# EAGLE design DAC (EAGLE 7.7.0)

## Sheet 1 of 2
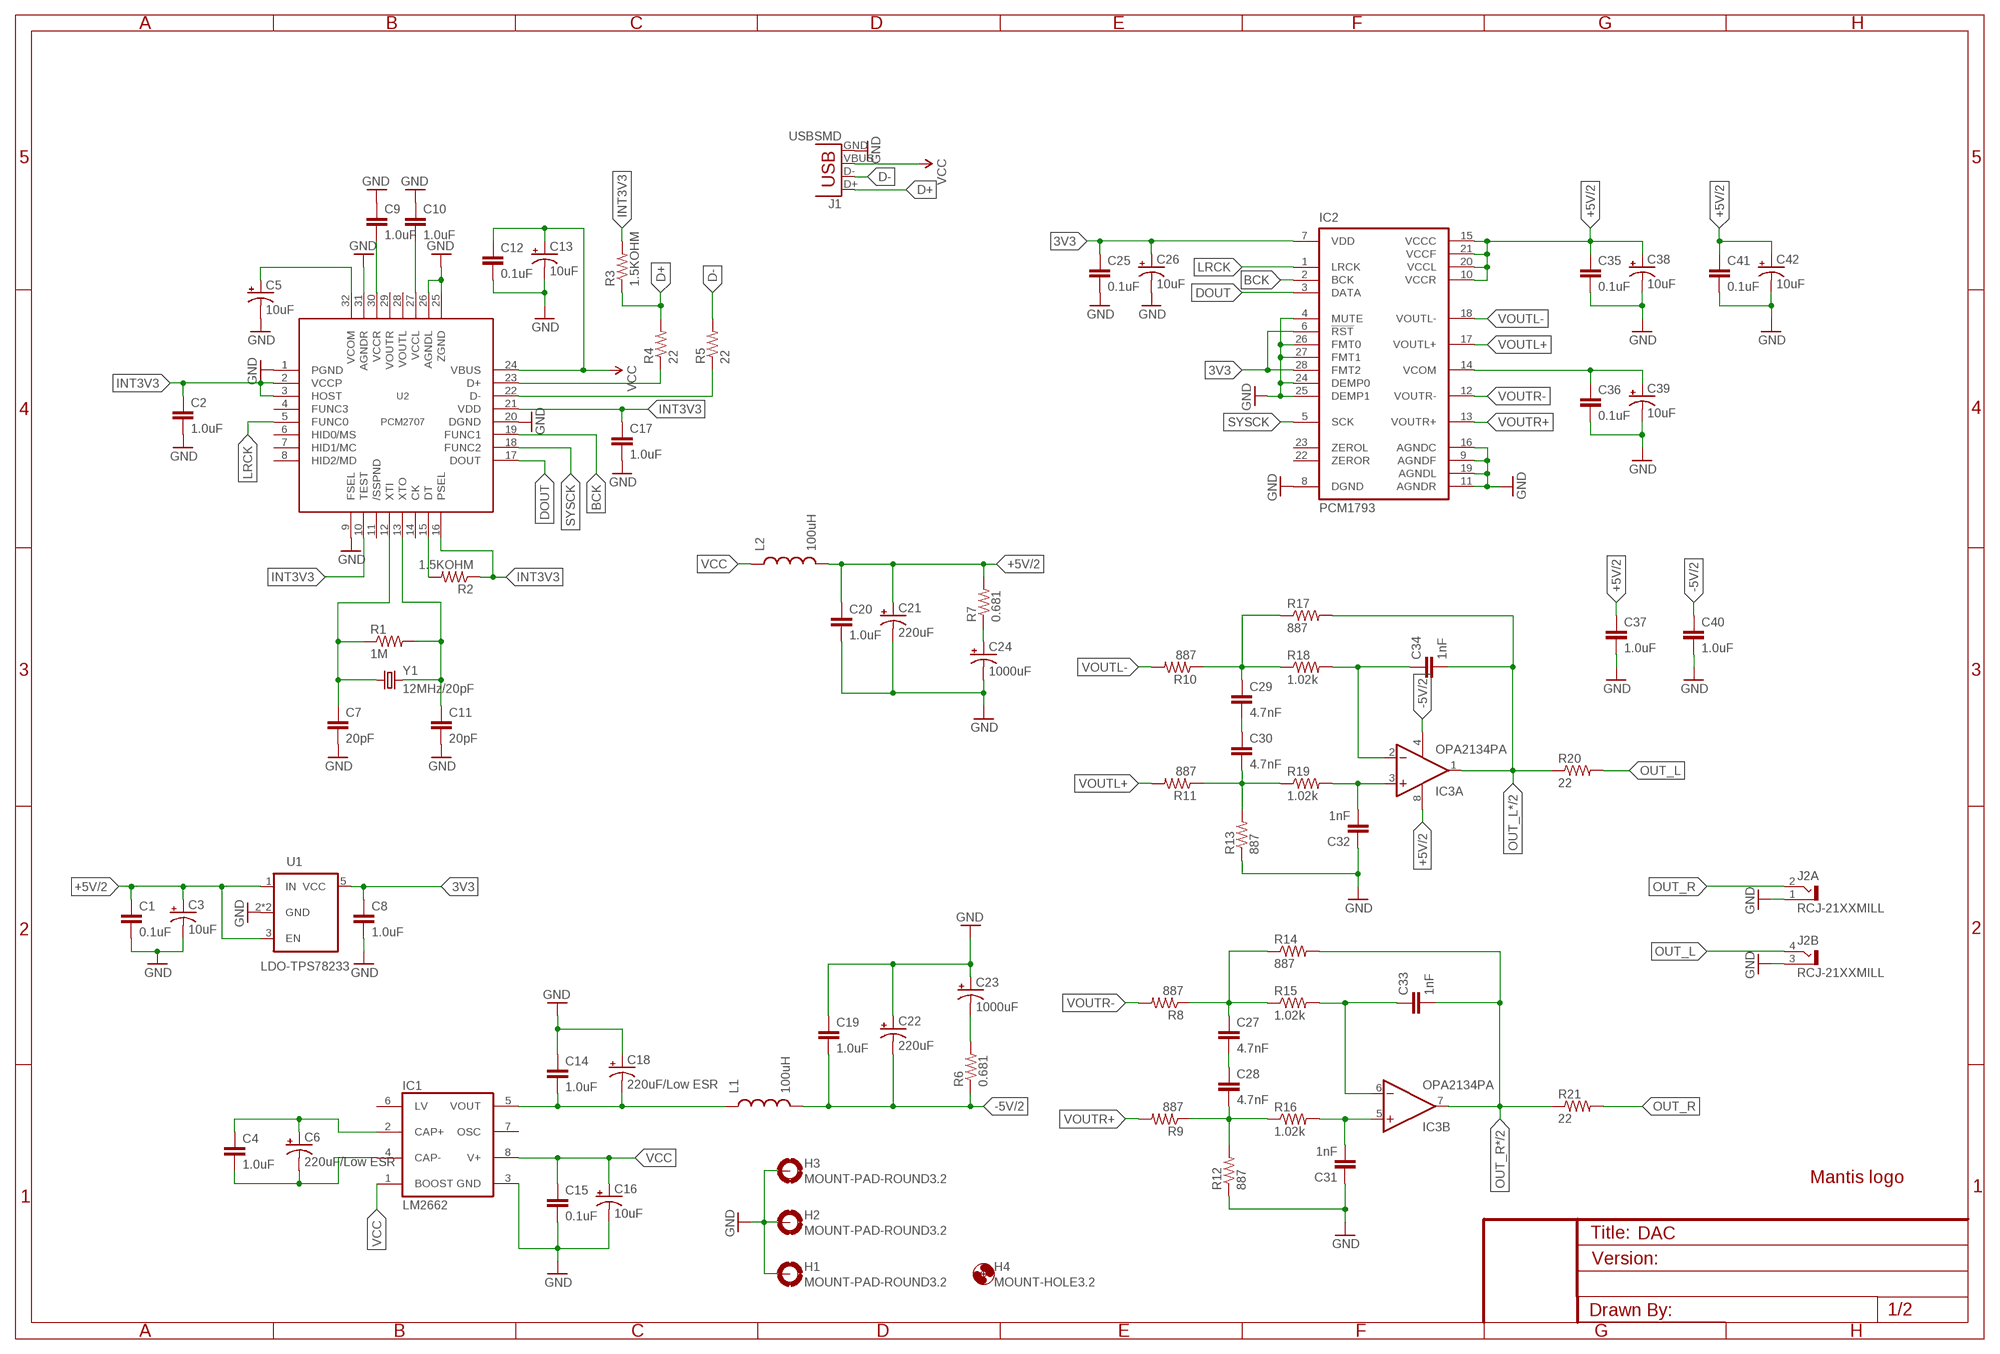
[diagram p0: schematic, sheet 1]

### Parts
C1  0.1uF  0.1UF-25V-5%(0603)  [0603-CAP]
C2  1.0uF  1.0UF-16V-10%(0603)  [0603-CAP]
C3  10uF  CAP_POLPTH2  [CPOL-RADIAL-10UF-25V]
C4  1.0uF  1.0UF-16V-10%(0603)  [0603-CAP]
C5  10uF  CAP_POLPTH2  [CPOL-RADIAL-10UF-25V]
C6  220uF/Low ESR  CAP_POLPTH8MM  [CPOL-RADIAL-8/3.5]
C7  20pF  18PF-50V-5%(0603)  [0603-CAP]
C8  1.0uF  1.0UF-25V-+80/-20(0805)"  [0805-CAP]
C9  1.0uF  1.0UF-16V-10%(0603)  [0603-CAP]
C10  1.0uF  1.0UF-16V-10%(0603)  [0603-CAP]
C11  20pF  18PF-50V-5%(0603)  [0603-CAP]
C12  0.1uF  0.1UF-25V-5%(0603)  [0603-CAP]
C13  10uF  CAP_POLPTH2  [CPOL-RADIAL-10UF-25V]
C14  1.0uF  1.0UF-16V-10%(0603)  [0603-CAP]
C15  0.1uF  0.1UF-25V-5%(0603)  [0603-CAP]
C16  10uF  CAP_POLPTH2  [CPOL-RADIAL-10UF-25V]
C17  1.0uF  1.0UF-16V-10%(0603)  [0603-CAP]
C18  220uF/Low ESR  CAP_POLPTH8MM  [CPOL-RADIAL-8/3.5]
C19  1.0uF  1.0UF-16V-10%(0603)  [0603-CAP]
C20  1.0uF  1.0UF-16V-10%(0603)  [0603-CAP]
C21  220uF  CAP_POLPTH8MM  [CPOL-RADIAL-8/3.5]
C22  220uF  CAP_POLPTH8MM  [CPOL-RADIAL-8/3.5]
C23  1000uF  CAP_POLPTH4  [CPOL-RADIAL-1000UF-25V]
C24  1000uF  CAP_POLPTH4  [CPOL-RADIAL-1000UF-25V]
C25  0.1uF  0.1UF-25V-5%(0603)  [0603-CAP]
C26  10uF  CAP_POLPTH2  [CPOL-RADIAL-10UF-25V]
C27  4.7nF  C5/4.5  [C5B4.5]
C28  4.7nF  C5/4.5  [C5B4.5]
C29  4.7nF  C5/4.5  [C5B4.5]
C30  4.7nF  C5/4.5  [C5B4.5]
C31  1nF  C5/2.5  [C5B2.5]
C32  1nF  C5/2.5  [C5B2.5]
C33  1nF  C5/2.5  [C5B2.5]
C34  1nF  C5/2.5  [C5B2.5]
C35  0.1uF  0.1UF-25V-5%(0603)  [0603-CAP]
C36  0.1uF  0.1UF-25V-5%(0603)  [0603-CAP]
C37  1.0uF  1.0UF-16V-10%(0603)  [0603-CAP]
C38  10uF  CAP_POLPTH2  [CPOL-RADIAL-10UF-25V]
C39  10uF  CAP_POLPTH2  [CPOL-RADIAL-10UF-25V]
C40  1.0uF  1.0UF-16V-10%(0603)  [0603-CAP]
C41  0.1uF  0.1UF-25V-5%(0603)  [0603-CAP]
C42  10uF  CAP_POLPTH2  [CPOL-RADIAL-10UF-25V]
H1  MOUNT-PAD-ROUND3.2  [3,2-PAD]
H2  MOUNT-PAD-ROUND3.2  [3,2-PAD]
H3  MOUNT-PAD-ROUND3.2  [3,2-PAD]
H4  MOUNT-HOLE3.2  [3,2]
IC1  LM2662  [SO08]
IC2  PCM1793  [SSOP28BU]
IC3  OPA2134PA  [DIL08]
J1  USBSMD  [USB-MINIB]
J2  RCJ-21XXMILL  [RCJ-21-MILL]
L1  100uH  INDUCTORBOURNS_SRN6045  [SRN6045]
L2  100uH  INDUCTORBOURNS_SRN6045  [SRN6045]
LOGO1  LOGO-MANTIS  [LOGO-MANTIS]
R1  1M  1MOHM-1/10W-1%(0603)  [0603-RES]
R2  1.5KOHM  1.5KOHM-1/10W-1%(0603)  [0603]
R3  1.5KOHM  1.5KOHM-1/10W-1%(0603)  [0603]
R4  22  22OHM1/10W1%(0603)  [0603-RES]
R5  22  22OHM1/10W1%(0603)  [0603-RES]
R6  0.681  1OHM1/10W1%(0603)  [0603-RES]
R7  0.681  1OHM1/10W1%(0603)  [0603-RES]
R8  887  RESISTORPTH-1/4W  [AXIAL-0.4]
R9  887  RESISTORPTH-1/4W  [AXIAL-0.4]
R10  887  RESISTORPTH-1/4W  [AXIAL-0.4]
R11  887  RESISTORPTH-1/4W  [AXIAL-0.4]
R12  887  RESISTORPTH-1/4W  [AXIAL-0.4]
R13  887  RESISTORPTH-1/4W  [AXIAL-0.4]
R14  887  RESISTORPTH-1/4W  [AXIAL-0.4]
R15  1.02k  RESISTORPTH-1/4W  [AXIAL-0.4]
R16  1.02k  RESISTORPTH-1/4W  [AXIAL-0.4]
R17  887  RESISTORPTH-1/4W  [AXIAL-0.4]
R18  1.02k  RESISTORPTH-1/4W  [AXIAL-0.4]
R19  1.02k  RESISTORPTH-1/4W  [AXIAL-0.4]
R20  22  RESISTORPTH-1/4W  [AXIAL-0.4]
R21  22  RESISTORPTH-1/4W  [AXIAL-0.4]
U1  LDO-TPS78233  [SOT23-5]
U2  PCM2707  [TQFP32-08]
Y1  12MHz/20pF  CRYSTALHC49US  [HC49US]

### Nets
3V3: C8.1 C25.1 C26.1(+) IC2.6(!RST) IC2.7(VDD) IC2.28(FMT2) U1.5(VCC)
+5V [pwr]: C1.1 C3.1(+) C20.1 C21.1(+) C35.1 C37.1 C38.1(+) C41.1 C42.1(+) IC2.10(VCCR) IC2.15(VCCC) IC2.20(VCCL) IC2.21(VCCF) IC3.8(A:V+) L2.2 R7.2 U1.1(IN) U1.3(EN) ; also sheet 2
-5V [pwr]: C19.2 C22.2(-) C40.1 IC3.4(A:V-) L1.2 R6.1 ; also sheet 2
BCK: IC2.2(BCK) U2.19(FUNC1)
D+: J1.D+ R3.1 R4.2
D+*: R4.1 U2.23(D+)
D-: J1.D- R5.2
D-*: R5.1 U2.22(D-)
DOUT: IC2.3(DATA) U2.17(DOUT)
GND: C1.2 C2.2 C3.2(-) C5.2(-) C7.2 C8.2 C9.1 C10.1 C11.2 C12.2 C13.2(-) C14.1 C15.2 C16.2(-) C17.2 C18.1(+) C19.1 C20.2 C21.2(-) C22.1(+) C23.+ C24.- C25.2 C26.2(-) C31.1 C32.1 C35.2 C36.2 C37.2 C38.2(-) C39.2(-) C40.2 C41.2 C42.2(-) H1.B3,2(MOUNT) H2.B3,2(MOUNT) H3.B3,2(MOUNT) IC1.3(GND) IC2.4(MUTE) IC2.8(DGND) IC2.9(AGNDF) IC2.11(AGNDR) IC2.16(AGNDC) IC2.19(AGNDL) IC2.24(DEMP0) IC2.25(DEMP1) IC2.26(FMT0) IC2.27(FMT1) J1.GND J2.1(A:S) J2.3(B:S) R12.P$1 R13.P$1 U1.2(GND) U1.4(GND) U2.1(PGND) U2.9(FSEL) U2.20(DGND) U2.25(ZGND) U2.26(AGNDL) U2.31(AGNDR) ; also sheet 2
INT3V3: C2.1 C17.1 R2.1 R3.2 U2.2(VCCP) U2.3(HOST) U2.10(TEST) U2.16(PSEL) U2.21(VDD)
LRCK: IC2.1(LRCK) U2.5(FUNC0)
N$1: R2.2 U2.15(DT)
N$2: C5.1(+) U2.32(VCOM)
N$3: C9.2 U2.30(VCCR)
N$4: C10.2 U2.27(VCCL)
N$5: C36.1 C39.1(+) IC2.14(VCOM)
N$8: C24.+ R7.1
N$9 [pwr]: C14.2 C18.2(-) IC1.5(VOUT) L1.1
N$10: C23.- R6.2
N$11 [pwr]: C4.1 C6.1(+) IC1.2(CAP+)
N$13 [pwr]: C4.2 C6.2(-) IC1.4(CAP-)
N$16: C29.2 C30.1
N$17 [analog]: C30.2 R11.P$1 R13.P$2 R19.P$1
N$18 [analog]: C29.1 R10.P$1 R17.P$1 R18.P$1
N$20 [analog]: C28.2 R9.P$1 R12.P$2 R16.P$1
N$21 [analog]: C27.1 R8.P$1 R14.P$1 R15.P$1
N$22: C27.2 C28.1
OPL+ [analog]: C32.2 IC3.3(A:+IN) R19.P$2
OPL- [analog]: C34.1 IC3.2(A:-IN) R18.P$2
OPR+ [analog]: C31.2 IC3.5(B:+IN) R16.P$2
OPR- [analog]: C33.1 IC3.6(B:-IN) R15.P$2
OUT_L [analog]: J2.4(B:T) R20.P$2
OUT_L* [analog]: C34.2 IC3.1(A:OUT) R17.P$2 R20.P$1 ; also sheet 2
OUT_R [analog]: J2.2(A:T) R21.P$2
OUT_R* [analog]: C33.2 IC3.7(B:OUT) R14.P$2 R21.P$1 ; also sheet 2
SYSCK: IC2.5(SCK) U2.18(FUNC2)
VCC [pwr]: C12.1 C13.1(+) C15.1 C16.1(+) IC1.1(BOOST) IC1.8(V+) J1.VBUS L2.1 U2.24(VBUS)
VOUTL+ [analog]: IC2.17(VOUTL+) R11.P$2
VOUTL- [analog]: IC2.18(VOUTL-) R10.P$2
VOUTR+ [analog]: IC2.13(VOUTR+) R9.P$2
VOUTR- [analog]: IC2.12(VOUTR-) R8.P$2
XTI: C7.1 R1.1 U2.12(XTI) Y1.1
XTO: C11.1 R1.2 U2.13(XTO) Y1.2
Unconnected: IC1.6(LV) IC1.7(OSC) IC2.22(ZEROR) IC2.23(ZEROL) U2.4(FUNC3) U2.6(HID0/MS) U2.7(HID1/MC) U2.8(HID2/MD) U2.11(/SSPND) U2.14(CK) U2.28(VOUTL) U2.29(VOUTR)

## Sheet 2 of 2
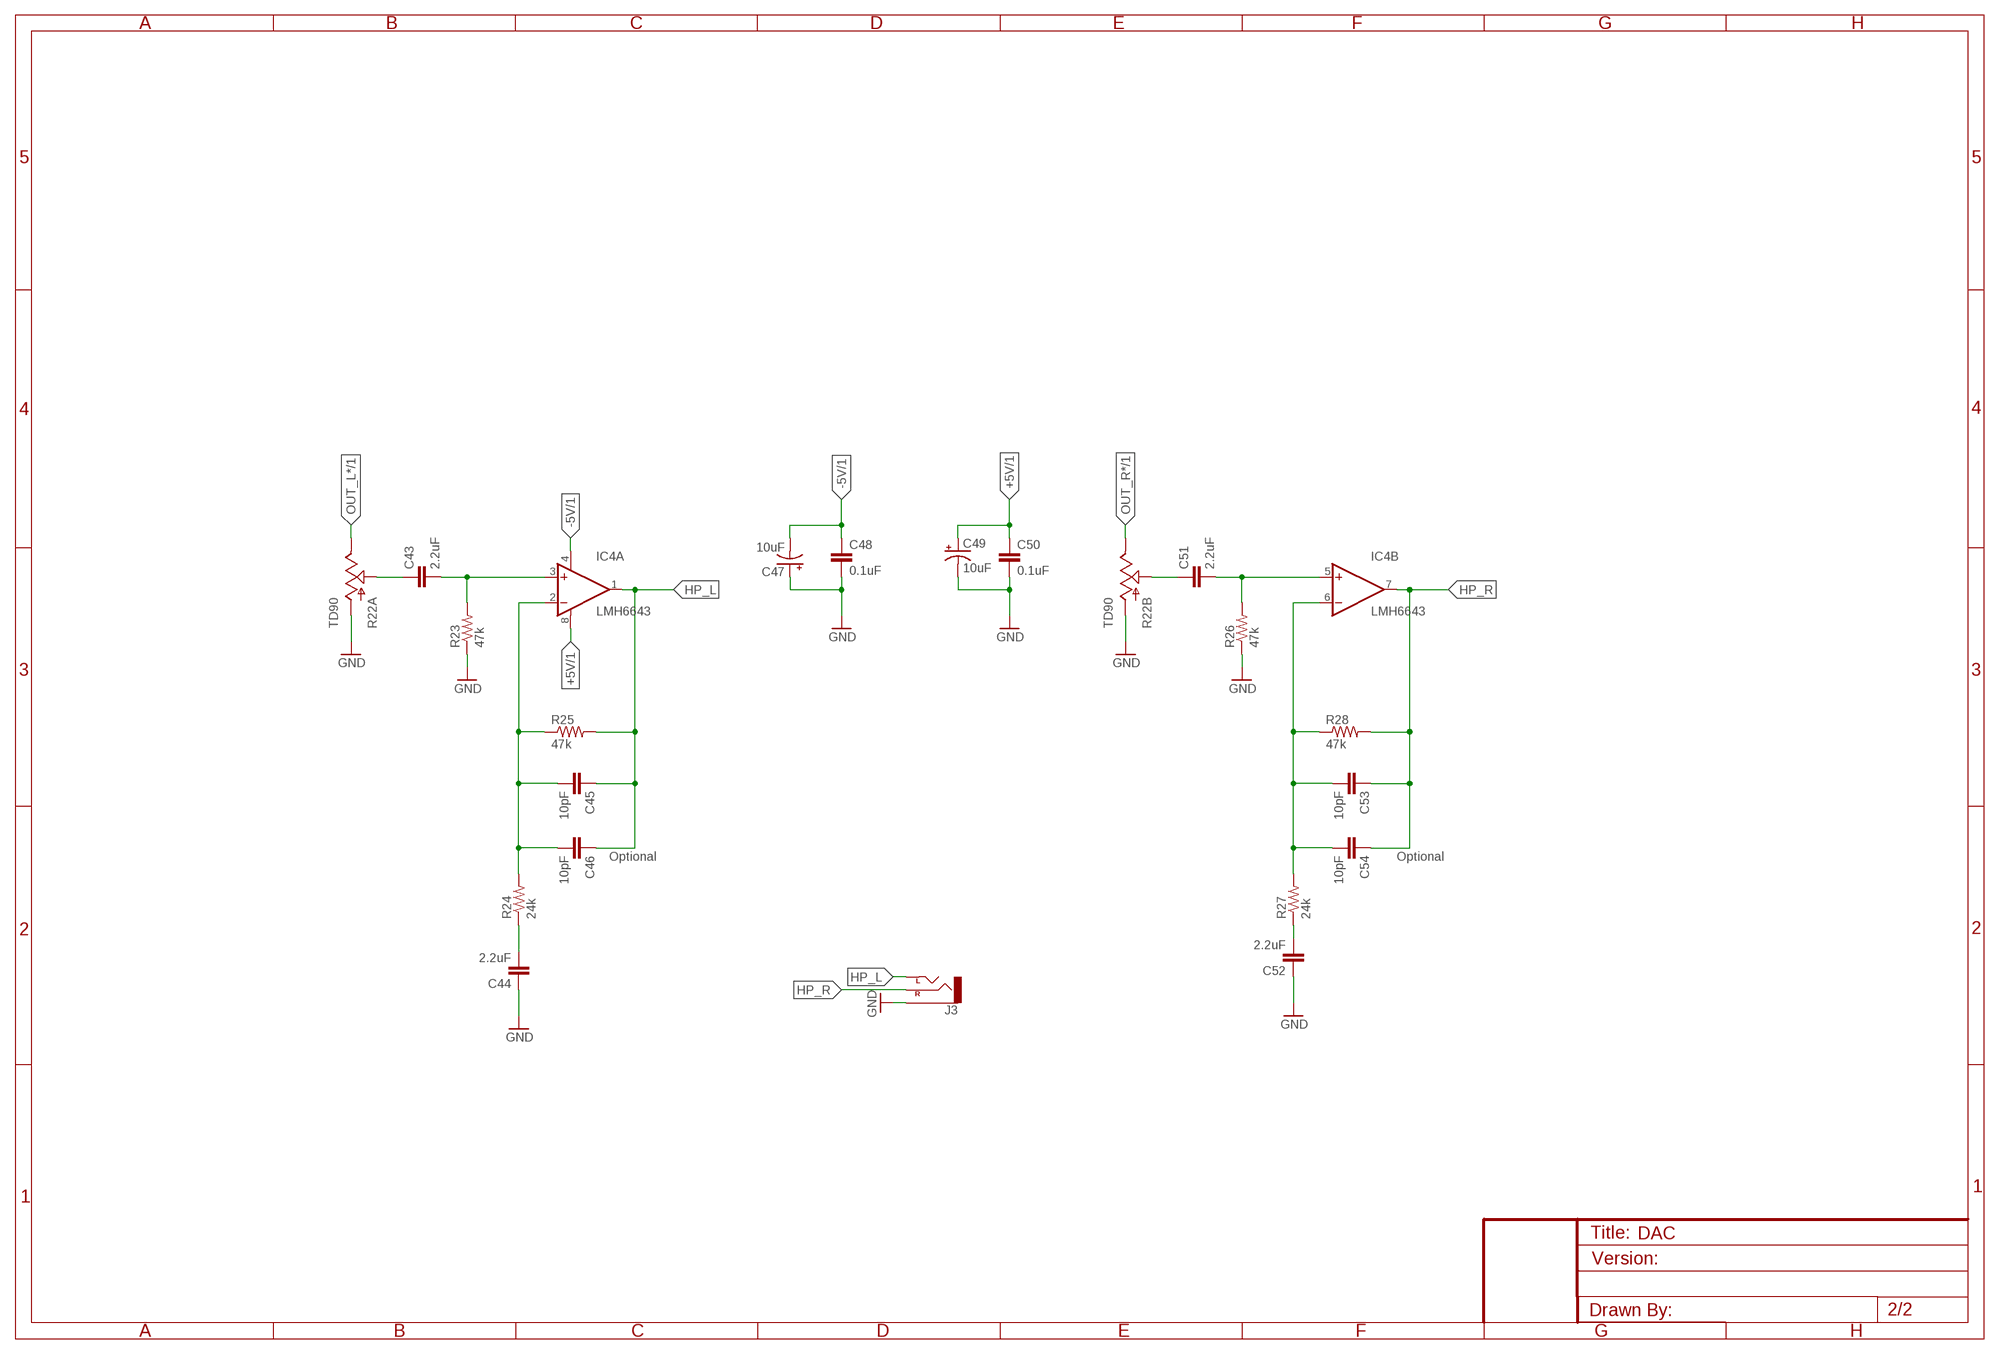
[diagram p1: schematic, sheet 2]

### Parts
C43  2.2uF  C5/5  [C5B5]
C44  2.2uF  C5/5  [C5B5]
C45  10pF  CAPPTH  [CAP-PTH-SMALL]
C46  10pF  10PF-50V-5%(0603)  [0603-CAP]
C47  10uF  CAP_POLPTH2  [CPOL-RADIAL-10UF-25V]
C48  0.1uF  1.0UF-16V-10%(0603)  [0603-CAP]
C49  10uF  CAP_POLPTH2  [CPOL-RADIAL-10UF-25V]
C50  0.1uF  1.0UF-16V-10%(0603)  [0603-CAP]
C51  2.2uF  C5/5  [C5B5]
C52  2.2uF  C5/5  [C5B5]
C53  10pF  CAPPTH  [CAP-PTH-SMALL]
C54  10pF  10PF-50V-5%(0603)  [0603-CAP]
IC4  LMH6643  [SO08]
J3  AUDIO-JACKPTH  [AUDIO-JACK]
R22  TD90  [PTD902]
R23  47k  RESISTORPTH-1/4W  [AXIAL-0.4]
R24  24k  RESISTORPTH-1/4W  [AXIAL-0.4]
R25  47k  RESISTORPTH-1/4W  [AXIAL-0.4]
R26  47k  RESISTORPTH-1/4W  [AXIAL-0.4]
R27  24k  RESISTORPTH-1/4W  [AXIAL-0.4]
R28  47k  RESISTORPTH-1/4W  [AXIAL-0.4]

### Nets
+5V [pwr]: C49.1(+) C50.1 IC4.8(A:V+) ; also sheet 1
-5V [pwr]: C47.2(-) C48.1 IC4.4(A:V-) ; also sheet 1
GND: C44.1 C47.1(+) C48.2 C49.2(-) C50.2 C52.1 J3.SLEEVE R22.R1.1(A:A) R22.R2.1(B:A) R23.P$1 R26.P$1 ; also sheet 1
HP_L [analog]: C45.1 C46.1 IC4.1(A:OUT) J3.TIP(LEFT) R25.P$2
HP_R [analog]: C53.1 C54.1 IC4.7(B:OUT) J3.RING(RIGHT) R28.P$2
N$7 [analog]: C45.2 C46.2 IC4.2(A:-IN) R24.P$2 R25.P$1
N$12 [analog]: C43.2 IC4.3(A:+IN) R23.P$2
N$14 [analog]: C51.1 R22.R2.2(B:S)
N$15 [analog]: C51.2 IC4.5(B:+IN) R26.P$2
N$19 [analog]: C53.2 C54.2 IC4.6(B:-IN) R27.P$2 R28.P$1
N$23 [analog]: C43.1 R22.R1.2(A:S)
N$24: C52.2 R27.P$1
N$25: C44.2 R24.P$1
OUT_L* [analog]: R22.R1.3(A:E) ; also sheet 1
OUT_R* [analog]: R22.R2.3(B:E) ; also sheet 1

### Notes on the sheet
- Optional | Optional

## Library data of the parts
C1 C12 C15 C25 C35 C36 C41 = SparkFun-Capacitors:0.1UF-25V-5%(0603): CAP-08604; PROD_ID: CAP-08604
C2 C4 C9 C10 C14 C17 C19 C20 C37 C40 = SparkFun-Capacitors:1.0UF-16V-10%(0603): CAP-00868; PROD_ID: CAP-00868
C3 C5 C13 C16 C23 C24 C26 C38 C39 C42 C47 C49 = SparkFun-Capacitors:CAP_POL: Capacitor Polarized These are standard SMD and PTH capacitors. Normally 10uF, 47uF, and 100uF in electrolytic and tantalum varieties. Always verify the external diameter of the through hole cap, it varies with capacity, voltage, and manufacturer. The EIA devices should be standard.
C6 C18 = my-cap:CAP_POL: Capacitor Polarized These are standard SMD and PTH capacitors. Normally 10uF, 47uF, and 100uF in electrolytic and tantalum varieties. Always verify the external diameter of the through hole cap, it varies with capacity, voltage, and manufacturer. The EIA devices should be standard.
C7 C11 = SparkFun-Capacitors:18PF-50V-5%(0603): CAP-08267; PROD_ID: CAP-08267; VALUE: 18pF
C8 = SparkFun-Capacitors:1.0UF-25V-+80/-20(0805): CAP-11625; PROD_ID: CAP-11625
C21 C22 = my-cap:CAP_POL: Capacitor Polarized These are standard SMD and PTH capacitors. Normally 10uF, 47uF, and 100uF in electrolytic and tantalum varieties. Always verify the external diameter of the through hole cap, it varies with capacity, voltage, and manufacturer. The EIA devices should be standard.; PACKAGE: 8/3.5
C27-C34 C43 C44 C51 C52 = capacitor-wima:C: CAPACITOR naming: grid - package width
C45 C53 = SparkFun-Capacitors:CAP: Capacitor Standard 0603 ceramic capacitor, and 0.1" leaded capacitor.
C46 C54 = SparkFun-Capacitors:10PF-50V-5%(0603): CAP-11812; PROD_ID: CAP-11812
C48 C50 = SparkFun-Capacitors:1.0UF-16V-10%(0603): CAP-00868; PROD_ID: CAP-00868; VALUE: 1.0uF
H1-H3 = holes:MOUNT-PAD-ROUND: MOUNTING PAD, round
H4 = holes:MOUNT-HOLE: MOUNTING HOLE with drill center marker
IC1 = my:LM2662: VOLTAGE CONVERTER
IC2 = burr-brown:PCM1793: AUDIO STEREO DIGITAL-TO-ANALOG CONVERTER 24-BIT, 192-kHz SAMPLING, ADVANCED SEGMENT Source: http://focus.ti.com/lit/ds/symlink/pcm1793.pdf; MF: TEXAS INSTRUMENT CONNECTORS; MPN: PCM1793DBR; OC_FARNELL: 1408322; OC_NEWARK: 61H5174
IC3 = linear:OPA2*: Dual Operational Amplifier Low Power, Single-Supply, Rail-To-Rail Operational Amplifier Source: http://focus.ti.com/lit/ds/symlink/opa2345.pdf http://focus.ti.com .. opa241.pdf http://focus.ti.com/lit/ds/symlink/opa2134.pdf
IC4 = my:LMH6643: Low Power, 130MHz, 75mA Rail-to-Rail Output Amplifier
J1 = SparkFun-Connectors:USB: USB Connectors USB-B-PTH is fully proven SKU : PRT-00139/CONN-08278 USB-miniB is fully proven SKU : PRT-00587 USB-A-PCB is untested. USB-A-H is throughly reviewed, but untested. Spark Fun Electronics SKU : PRT-00437 USB-B-SMT is throughly reviewed, but untested. Needs silkscreen touching up. USB-A-S has not been used/tested USB-MB-H has not been used/tested USB-MICROB has been used. CONN-09505; PROD_ID: CONN-08193
J2 = my:RCJ-21XX: Dual RCA Jack
J3 = SparkFun-Connectors:AUDIO-JACK: 3.5mm Audio Jack Simple 3.5mm common PCB mount audio jack. Variant PTH is our storefront SKU PRT-08032
L1 L2 = SparkFun-Passives:INDUCTOR: Inductors Basic Inductor/Choke - 0603 and 1206. Footprints are not proven and vary greatly between part numbers. INDUCTOR POWER 3.3UH 4.0A SMD 0.197" L x 0.197" W x 0.177" H (5.00mm x 5.00mm x 4.50mm); MOUSER_ID: 652-SRN6045-101M; PROD_ID: NDUC-11627; VALUE: 33uH
LOGO1 = my:LOGO-MANTIS: Mantis logo
R1 = SparkFun-Resistors:1MOHM-1/10W-1%(0603): RES-07868; PROD_ID: RES-07868
R2 R3 = SparkFun-Resistors:1.5KOHM-1/10W-1%(0603): RES-08306; PROD_ID: RES-08306
R4 R5 = SparkFun-Resistors:22OHM1/10W1%(0603): RES-08698; PROD_ID: RES-08698
R6 R7 = SparkFun-Resistors:1OHM1/10W1%(0603): RES-08269; PROD_ID: RES-08269; VALUE: 1
R8-R21 R23-R28 = SparkFun-Resistors:RESISTOR: Resistor Basic schematic elements and footprints for 0603, 1206, and PTH resistors.
R22 = my:TD90: PTD90 Series - 9 mm Multi-Ganged Potentiometer
U1 = SparkFun-PowerIC:LDO-TPS78233: Voltage Regulator LDO 500nA Ground Current, 150mA, Ultra-Low Quiescent Current Low-Dropout Linear Regulator.
U2 = my:PCM2707: 98dB SNR Stereo USB2.0 FS DAC with line-out and S/PDIF output, Bus/Self-powered (S/W Control + I2S)
Y1 = SparkFun-FreqCtrl:CRYSTAL: Various standard crystals. Proven footprints.; MOUSER_ID: 73-XT49S1200-20

## Net classes
0 default: width 0.406 mm
1 pwr: width 0.813 mm
2 analog: width 0.61 mm

## Board
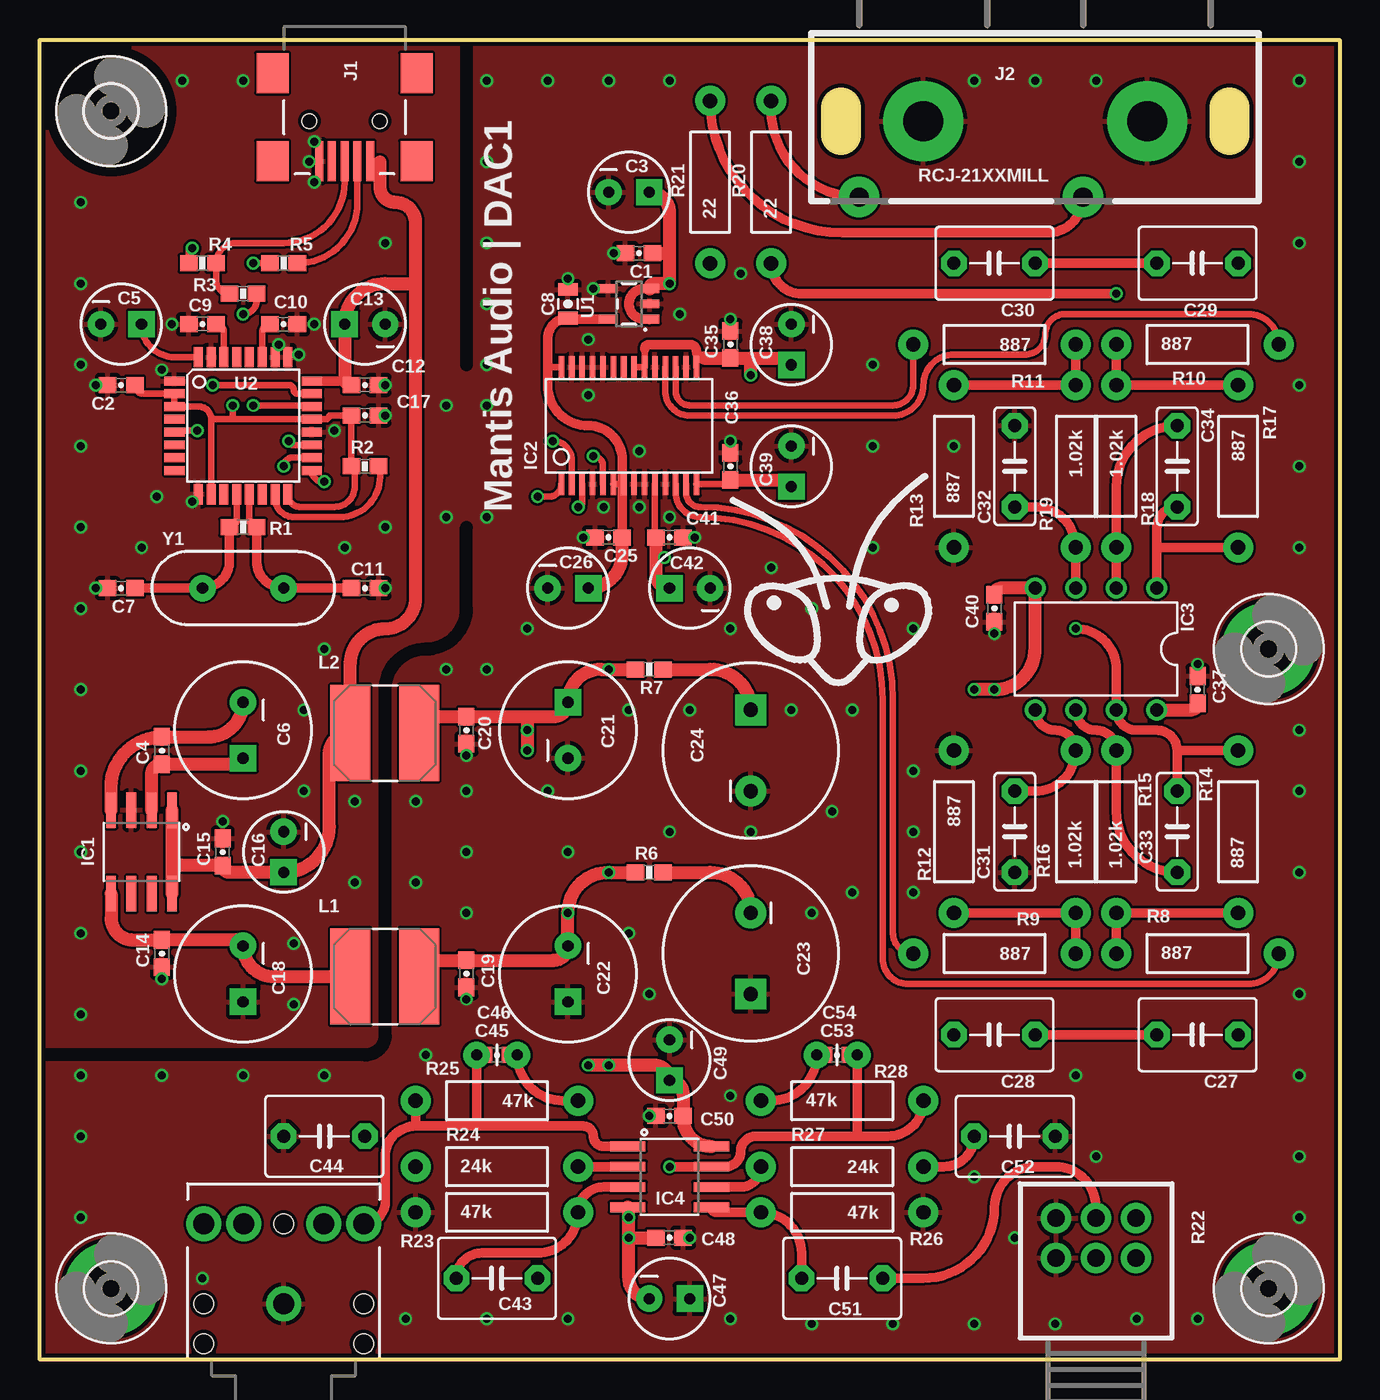
[diagram p2: board, top side]
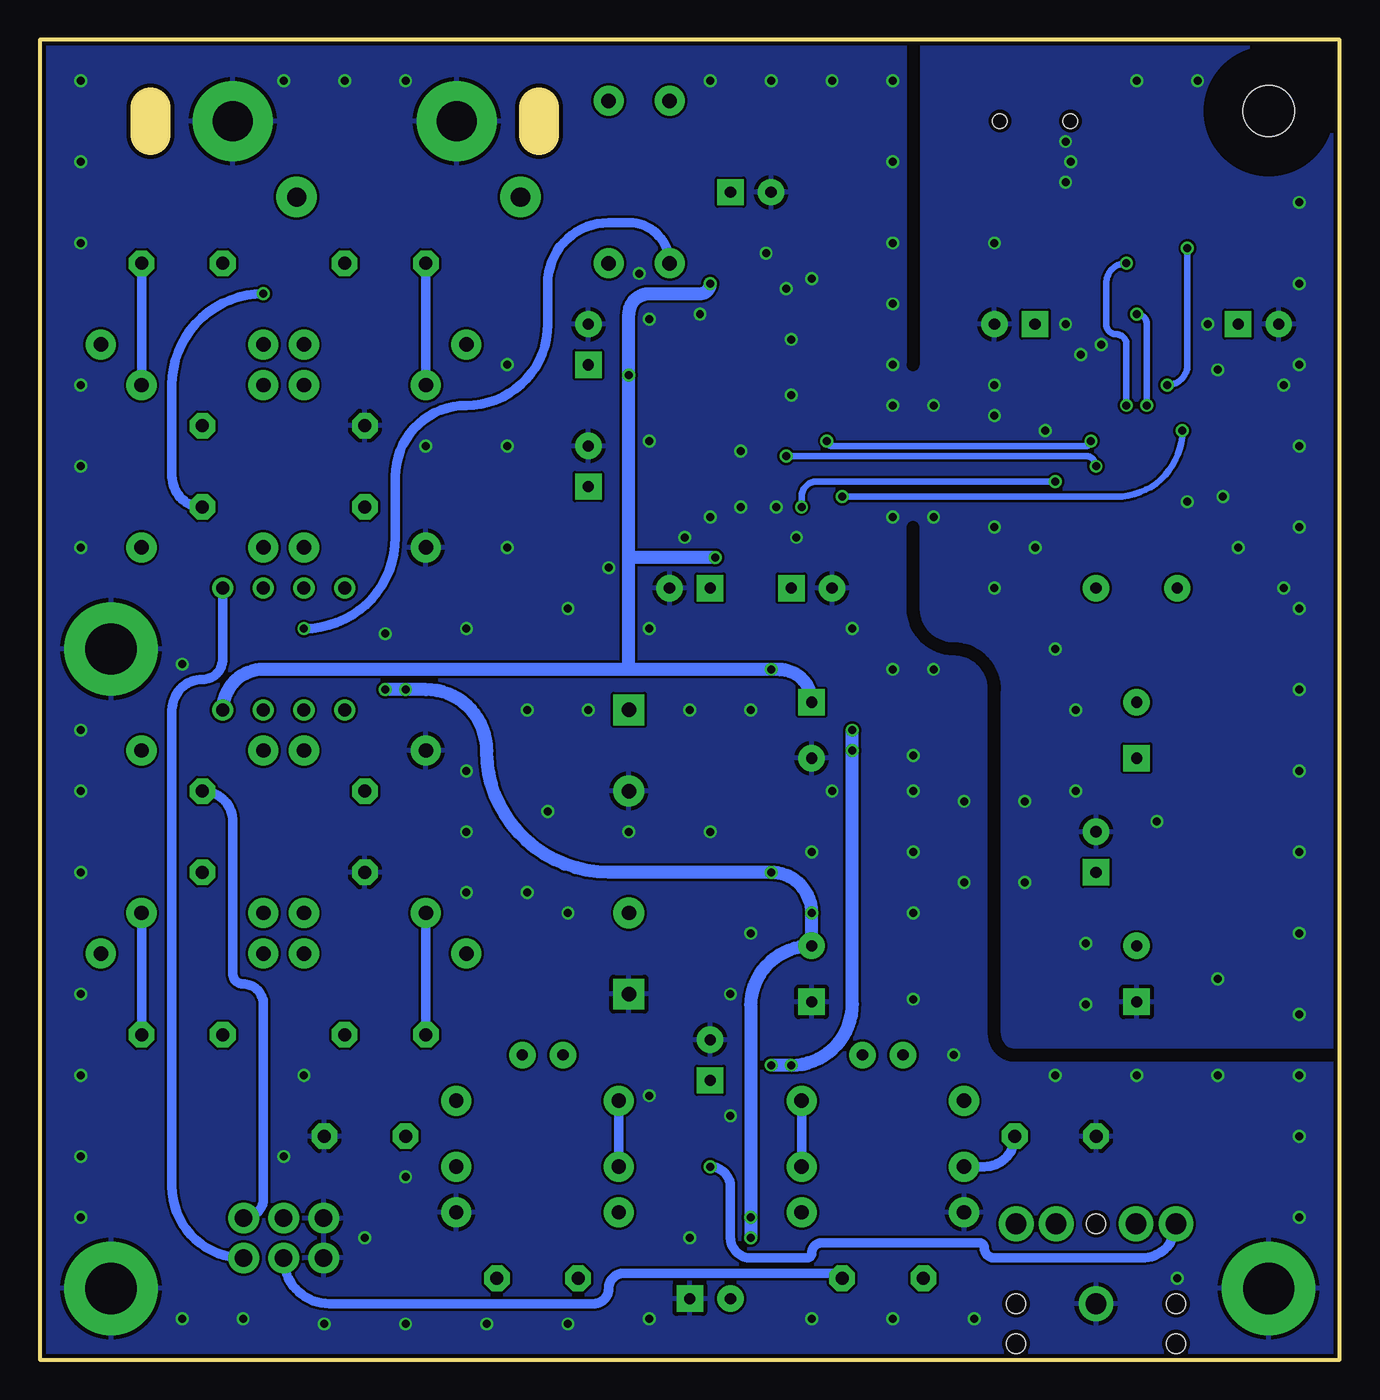
[diagram p3: board, bottom side, seen from below]

Size 81.28 x 82.55 mm. Coordinates in mm from the lower left corner, seen from the top.
Outline: 0,82.55 81.28,82.55 81.28,0 0,0 0,82.55
Copper layers (1*16): Top 0.035mm / dielectric 1.5mm / Bottom 0.035mm
Design rules "SeeedStudio_2layer_DRU_no_angle_20140221": minimum track width 6mil, minimum drill 12mil, track to track 6mil, track to pad 6mil, pad to pad 6mil, via to via 6mil, smd to smd 0mil, copper to edge 10mil, drill to drill 10mil, minimum pad ring 10mil, minimum via ring 6mil, stop-mask expansion 2mil, vias tented up to drill 100mil, thermal gap 10mil
tRestrict: 7 lines
bRestrict: 7 lines

### Footprints (pad centres in the part's own frame; a part is rotated, then mirrored left to right if it is on the bottom)
0603-CAP = smd 1.1 x 1: 1 -0.85,0; 2 0.85,0
CPOL-RADIAL-10UF-25V = drill 0.7 pad 1.651 square: 1 1.27,0 | drill 0.7 pad 1.651: 2 -1.27,0
CPOL-RADIAL-8/3.5 = drill 0.7 pad 1.651 square: 1 1.75,0 | drill 0.7 pad 1.651: 2 -1.75,0
0805-CAP = smd 0.8 x 1.2: 1 -0.9,0; 2 0.9,0
CPOL-RADIAL-1000UF-25V = drill 0.9 pad 1.93 square: + 2.54,0 | drill 0.9 pad 1.93: - -2.54,0
C5B4.5 = drill 0.813 pad 1.6 octagon: 1 -2.54,0; 2 2.54,0
C5B2.5 = drill 0.813 pad 1.6 octagon: 1 -2.54,0; 2 2.54,0
C5B5 = drill 0.813 pad 1.6 octagon: 1 -2.54,0; 2 2.54,0
CAP-PTH-SMALL = drill 0.7 pad 1.651: 1 0,0; 2 2.54,0
3,2-PAD = drill 3.2 pad 5.842: B3,2 0,0
3,2 = hole 3.2: 0,0
SO08 = smd 0.61 x 2.21: 1 -1.905,-2.616; 2 -0.635,-2.616; 3 0.635,-2.616; 4 1.905,-2.616; 5 1.905,2.616; 6 0.635,2.616; 7 -0.635,2.616; 8 -1.905,2.616
SSOP28BU = smd 0.348 x 1.397: 1 -4.225,-3.656; 2 -3.575,-3.656; 3 -2.925,-3.656; 4 -2.275,-3.656; 5 -1.625,-3.656; 6 -0.975,-3.656; 7 -0.325,-3.656; 8 0.325,-3.656; 9 0.975,-3.656; 10 1.625,-3.656; 11 2.275,-3.656; 12 2.925,-3.656; 13 3.575,-3.656; 14 4.225,-3.656; 15 4.225,3.656; 16 3.575,3.656; 17 2.925,3.656; 18 2.275,3.656; 19 1.625,3.656; 20 0.975,3.656; 21 0.325,3.656; 22 -0.325,3.656; 23 -0.975,3.656; 24 -1.625,3.656; 25 -2.275,3.656; 26 -2.925,3.656; 27 -3.575,3.656; 28 -4.225,3.656
DIL08 = drill 0.813 pad 1.27: 1 -3.81,-3.81; 2 -1.27,-3.81; 3 1.27,-3.81; 4 3.81,-3.81; 5 3.81,3.81; 6 1.27,3.81; 7 -1.27,3.81; 8 -3.81,3.81
USB-MINIB = smd 2.5 x 0.5: D+ 2.5,0; D- 2.5,0.8; GND 2.5,-1.6; ID 2.5,-0.8; VBUS 2.5,1.6 | smd 2.5 x 2: MTN1 -3,4.5; MTN2 2.5,4.5; MTN3 -3,-4.5; MTN4 2.5,-4.5 | hole 0.9: 0,2.2; 0,-2.2
RCJ-21-MILL = drill 2.5 pad 5: 1 7,0; 3 -7,0 | drill 1.2 pad 2.54: 2 3,-4.75; 4 -11,-4.75
AUDIO-JACK = drill 1.3 pad 2.184: RING 5,5; RSH 5,2.5; SLEEVE 0,0; TIP 5,-5; TSH 5,-2.5 | hole 1.2: 0,5; -2.5,5; -2.5,-5; 0,-5; 5,0
SRN6045 = smd 2.5 x 6: 1 -2.175,-0.175; 2 2.125,-0.175
0603-RES = smd 1.1 x 1: 1 -0.85,0; 2 0.85,0
0603 = smd 1.1 x 1: 1 -0.85,0; 2 0.85,0
AXIAL-0.4 = drill 0.9 pad 1.88: P$1 -5.08,0; P$2 5.08,0
PTD902 = drill 1.1 pad 1.93: R1.1 0,-2.5; R1.2 0,0; R1.3 0,2.5; R2.1 -2.5,-2.5; R2.2 -2.5,0; R2.3 -2.5,2.5
SOT23-5 = smd 0.55 x 1.2: 1 -0.95,-1.3; 2 0,-1.3; 3 0.95,-1.3; 4 0.95,1.3; 5 -0.95,1.3
TQFP32-08 = smd 1.27 x 0.559: 1 -4.293,2.8; 2 -4.293,2; 3 -4.293,1.2; 4 -4.293,0.4; 5 -4.293,-0.4; 6 -4.293,-1.2; 7 -4.293,-2; 8 -4.293,-2.8; 17 4.293,-2.8; 18 4.293,-2; 19 4.293,-1.2; 20 4.293,-0.4; 21 4.293,0.4; 22 4.293,1.2; 23 4.293,2; 24 4.293,2.8 | smd 0.559 x 1.27: 9 -2.8,-4.293; 10 -2,-4.293; 11 -1.2,-4.293; 12 -0.4,-4.293; 13 0.4,-4.293; 14 1.2,-4.293; 15 2,-4.293; 16 2.8,-4.293; 25 2.8,4.293; 26 2,4.293; 27 1.2,4.293; 28 0.4,4.293; 29 -0.4,4.293; 30 -1.2,4.293; 31 -2,4.293; 32 -2.8,4.293
HC49US = drill 0.7 pad 1.651: 1 -2.54,0; 2 2.54,0

### Placement (x,y rotation side)
C1  37.47,69.22 180 top
C2  5.08,60.96 180 top
C3  36.83,73.03 0 top
C4  7.62,38.1 90 top
C5  5.08,64.77 0 top
C6  12.7,39.37 270 top
C7  5.08,48.26 180 top
C8  33.02,66.04 90 top
C9  10.16,64.77 0 top
C10  15.24,64.77 180 top
C11  20.32,48.26 0 top
C12  20.32,60.96 0 top
C13  20.32,64.77 180 top
C14  7.62,25.4 90 top
C15  11.43,31.75 90 top
C16  15.24,31.75 270 top
C17  20.32,59.05 0 top
C18  12.7,24.13 270 top
C19  26.67,24.13 90 top
C20  26.67,39.37 270 top
C21  33.02,39.37 90 top
C22  33.02,24.13 270 top
C23  44.45,25.4 270 top
C24  44.45,38.1 90 top
C25  35.56,51.44 180 top
C26  33.02,48.26 0 top
C27  72.39,20.32 180 top
C28  59.69,20.32 180 top
C29  72.39,68.58 180 top
C30  59.69,68.58 180 top
C31  60.96,33.02 90 top
C32  60.96,55.88 270 top
C33  71.12,33.02 90 top
C34  71.12,55.88 270 top
C35  43.18,63.5 90 top
C36  43.18,55.88 90 top
C37  72.39,41.91 90 top
C38  46.99,63.5 270 top
C39  46.99,55.88 270 top
C40  59.69,46.99 270 top
C41  39.37,51.44 0 top
C42  40.64,48.26 180 top
C43  28.57,5.08 180 top
C44  17.78,13.97 0 top
C45  27.3,19.05 0 top
C46  28.57,19.05 0 top
C47  39.37,3.81 0 top
C48  39.37,7.62 0 top
C49  39.37,18.73 270 top
C50  39.37,15.24 180 top
C51  50.16,5.08 180 top
C52  60.96,13.97 180 top
C53  51.12,19.05 180 top
C54  49.85,19.05 180 top
H1  76.83,4.45 0 top
H2  4.45,4.45 0 top
H3  76.83,44.45 0 top
H4  4.45,78.11 0 top
IC1  6.35,31.75 180 top
IC2  36.83,58.42 0 top
IC3  66.04,44.45 180 top
IC4  39.37,11.43 270 top
J1  19.05,77.47 270 top
J2  62.23,77.47 0 top
J3  15.24,3.49 90 top
L1  21.59,24.13 0 top
L2  21.59,39.37 0 top
LOGO1  49.85,48.9 0 top
R1  12.7,52.07 0 top
R2  20.32,55.88 0 top
R3  12.7,66.67 0 top
R4  10.16,68.58 0 top
R5  15.24,68.58 0 top
R6  38.1,30.48 0 top
R7  38.1,43.18 180 top
R8  72.39,25.4 0 top
R9  59.69,25.4 180 top
R10  72.39,63.5 0 top
R11  59.69,63.5 180 top
R12  57.15,33.02 270 top
R13  57.15,55.88 90 top
R14  74.93,33.02 90 top
R15  67.31,33.02 90 top
R16  64.77,33.02 90 top
R17  74.93,55.88 270 top
R18  67.31,55.88 270 top
R19  64.77,55.88 270 top
R20  45.72,73.66 90 top
R21  41.91,73.66 90 top
R22  66.04,6.35 270 top
R23  28.57,9.21 0 top
R24  28.57,12.06 0 top
R25  28.57,16.19 180 top
R26  50.16,9.21 180 top
R27  50.16,12.06 180 top
R28  50.16,16.19 0 top
U1  36.83,66.04 90 top
U2  12.7,58.42 0 top
Y1  12.7,48.26 0 top

### Tracks (layer width: path | path; a pad name or v marks a point on that pad's centre or on a via)
3V3
  Top 0.406: U1.5 arc90 35.48,65.14 | IC2.28 31.9,62.08 arc-90 31.75,62.23 | IC2.6 IC2.7 arc90 36.41,54.67 36.41,54.61
  Top 0.61: C25.1 36.41,54.61 36.41,56.3 arc90 34.29,58.42 arc-90 31.75,60.96 31.75,62.23 31.75,63.87 arc-90 C8.1 arc90 33.07,65.09 U1.5
  Top 0.813: C26.1 arc90 36.41,50.38 C25.1
+5V  (via drill 0.5)
  Top 0.406: IC2.21 IC2.20 37.8,63.2 | IC2.15 41.05,63.09 | IC2.10 38.45,51.5
  Top 0.61: 41.49,62.65 arc-90 41.05,63.09 arc90 40.64,63.5 38.1,63.5 arc90 37.8,63.2 | U1.3 37.78,66.99 arc90 36.83,66.04 arc90 37.78,65.09 U1.1 arc90 38.1,65.06
  Top 0.813: L2.2 arc-90 24.74,40.22 C20.1 30.48,40.22 | 30.48,40.22 32.12,40.22 arc90 C21.1 arc-90 35.08,43.18 v35.56,43.18 R7.2 | IC3.8 71.97,40.64 arc90 C37.1 | 41.49,62.65 C35.1 44.45,62.65 | 44.45,62.65 46.57,62.65 arc-90 C38.1 | 38.45,51.5 arc90 C41.1 38.52,50.16 | 38.52,50.16 38.52,49.11 arc90 C42.1 | 30.48,40.22 v30.48,39.37 v30.48,38.1 | IC4.8 arc-90 40.22,15.1 C50.1 40.22,16.61 arc90 C49.1 arc90 38.42,18.41 v35.56,18.41 v34.29,18.41 | U1.3 arc90 U1.3 arc-90 38.45,67.31 v39.37,67.31 39.37,69.22 | 38.52,50.16 v39.05,50.16 | v44.45,61.59 44.45,62.65 | 39.37,69.22 39.37,71.75 arc90 C3.1 | C1.1 39.37,69.22
  Bottom 0.813: 44.45,43.18 v35.56,43.18 35.08,43.18 arc90 C21.1 | 44.45,43.18 67.31,43.18 arc-90 IC3.8 | v30.48,39.37 v30.48,38.1 30.48,22.23 arc90 v34.29,18.41 v35.56,18.41 | 44.45,43.18 44.45,50.16 | 44.45,50.16 v44.45,61.59 44.45,65.41 arc90 43.18,66.67 40.01,66.67 arc-90 v39.37,67.31 | v39.05,50.16 44.45,50.16
-5V  (via drill 0.5)
  Top 0.813: L1.2 arc-90 24.74,24.98 C19.2 32.12,24.98 arc90 C22.2 v33.02,27.94 arc-90 v35.56,30.48 R6.1 | C40.1 arc-90 60.11,48.26 IC3.4 62.23,44.45 arc-90 v59.69,41.91 v58.42,41.91 | v36.83,7.62 C48.1 | C47.2 arc-90 36.83,5.08 v36.83,7.62 | v36.83,7.62 v36.83,8.89 36.83,9.45 arc90 IC4.4
  Bottom 0.813: v59.69,41.91 v58.42,41.91 57.15,41.91 arc90 53.34,38.1 arc-90 45.72,30.48 v35.56,30.48 arc90 v33.02,27.94 C22.2 33.05,25.88 arc-90 36.83,22.1 v36.83,8.89 v36.83,7.62
BCK  (via drill 0.5)
  Top 0.406: U2.19 15.8,57.22 arc-90 v15.56,57.47 | v32.07,57.47 arc-90 33.26,56.28 IC2.2
  Bottom 0.406: v15.56,57.47 arc90 15.88,57.15 31.75,57.15 arc90 v32.07,57.47
D+
  Top 0.406: J1.D+ 19.05,73.66 arc-90 15.24,69.85 12.28,69.85 arc90 R4.2 11.01,67.52 arc90 R3.1
D+*  (via drill 0.5)
  Top 0.406: U2.23 16.1,60.42 arc-90 15.88,60.64 arc90 15.56,60.96 v10.79,60.96 | v9.53,69.53 arc90 9.31,69.32 R4.1
  Bottom 0.406: v10.79,60.96 arc-90 9.53,62.23 v9.53,69.53
D-
  Top 0.406: R5.2 arc90 19.85,72.34 J1.D-
D-*  (via drill 0.5)
  Top 0.406: v13.34,59.69 16.92,59.69 arc-90 U2.22 | v13.34,68.58 R5.1
  Bottom 0.406: v13.34,59.69 13.34,63.5 arc-90 13.97,64.14 arc90 14.61,64.77 14.61,67.31 arc90 v13.34,68.58
DOUT  (via drill 0.5)
  Top 0.406: U2.17 arc90 17.68,54.93 v17.78,54.93 | v33.66,53.34 arc90 33.91,53.59 IC2.3
  Bottom 0.406: v17.78,54.93 32.7,54.93 arc-90 33.66,53.98 v33.66,53.34
GND  (via drill 0.5)
  other vias: 21.59,60.96 9.53,53.66 7.3,53.98 18.41,58.1 35.24,53.34 37.47,56.83 34.29,60.33 16.19,62.87 17.14,64.77 8.26,64.77 21.59,59.05 3.49,60.96 7.62,23.81 11.43,33.66 33.97,51.44 30.48,45.72 19.68,34.92 19.68,29.84 21.59,48.26 3.49,48.26 19.05,50.8 6.35,50.8 7.62,61.91 14.92,63.5 17.14,73.66 17.14,76.2 16.83,74.93 27.94,52.7 27.94,62.23 2.54,21.59 2.54,26.67 2.54,31.75 2.54,36.83 2.54,41.91 2.54,46.99 2.54,52.07 2.54,57.15 2.54,62.23 2.54,67.31 2.54,72.39 8.89,80.01 12.7,80.01 27.94,80.01 31.75,80.01 35.56,80.01 21.59,69.85 21.59,52.07 17.78,44.45 16.51,40.64 16.51,35.56 15.88,26.04 15.88,22.23 26.67,37.78 26.67,22.54 43.18,57.47 43.18,65.09 40.96,51.44 59.69,45.4 72.39,43.5 39.37,52.7 23.5,34.92 23.5,29.84 25.4,43.18 27.94,43.18 43.18,45.72 48.26,46.99 46.99,40.64 50.8,40.64 54.61,45.72 52.07,50.8 45.72,49.53 52.07,57.15 52.07,62.23 57.15,57.15 49.53,34.29 44.45,33.02 39.37,33.02 33.02,31.75 26.67,27.94 31.75,35.56 36.83,40.64 40.64,40.64 50.8,29.21 48.26,27.94 54.61,29.21 54.61,33.02 54.61,36.83 26.67,31.75 26.67,35.56 39.37,80.01 58.42,80.01 62.23,80.01 66.04,80.01 78.74,80.01 78.74,74.93 78.74,69.85 78.74,60.96 78.74,55.88 78.74,50.8 78.74,39.37 78.74,35.56 78.74,30.48 78.74,22.86 78.74,17.78 78.74,8.89 40.64,7.62 43.18,16.51 38.1,22.86 36.83,26.67 2.54,13.97 2.54,17.78 7.62,17.78 64.77,17.78 38.1,15.24 2.54,8.89 10.16,5.08 22.86,2.54 27.94,2.54 33.02,2.54 43.18,2.54 48.26,2.22 53.34,2.22 58.42,2.22 63.5,2.22 68.58,2.54 72.39,2.54 78.74,12.7 58.42,11.43 66.04,12.7 60.96,7.62 37.47,53.34 12.7,17.78 17.78,17.78 24.13,19.05 27.94,66.04 27.94,69.85 27.94,74.93 27.94,59.69 25.4,52.7 25.4,59.69 34.29,63.82 40.01,65.41 43.81,67.94 33.02,67.63 34.61,66.99 35.88,69.22
  pour Top (rank 2): 0,82.55 81.28,82.55 81.28,0 0,0
  pour Bottom (rank 2): 0,82.55 81.28,82.55 81.28,0 0,0
HP_L
  Top 0.61: C46.1 C45.1 27.3,14.61 | IC4.1 35.24,13.34 arc-90 34.61,13.97 arc90 33.97,14.61 27.3,14.61 | 27.3,14.61 23.5,14.61 | 23.5,14.61 arc90 21.59,12.7 21.59,9.84 arc-90 J3.TIP | R25.P$2 23.5,14.61
HP_R  (via drill 0.5)
  Top 0.61: v39.37,12.06 IC4.7 42.86,12.06 arc90 43.81,13.02 arc-90 44.77,13.97 51.12,13.97 | C54.1 C53.1 51.12,13.97 | 51.12,13.97 53.02,13.97 arc90 R28.P$2
  Bottom 0.61: v39.37,12.06 arc90 38.1,10.79 38.1,7.62 arc-90 36.83,6.35 33.34,6.35 arc-90 33.02,6.67 arc90 32.38,7.3 22.54,7.3 arc90 22.23,6.99 arc-90 21.59,6.35 12.38,6.35 arc-90 J3.RING
INT3V3  (via drill 0.5)
  Top 0.406: C2.1 arc90 6.47,60.42 U2.2 U2.3 9.91,59.62 arc-90 10.71,58.82 | U2.10 10.7,57.33 arc90 10.71,57.34 10.71,58.82 | 12.06,58.82 U2.21 17.86,58.82 arc90 18.1,59.05 C17.1 R2.1 arc-90 19.68,55.66 19.68,54.61 arc-90 18.41,53.34 16.29,53.34 arc-90 U2.16 | 12.06,58.82 10.71,58.82 | R3.2 13.55,66.25 arc-90 v12.7,65.41 | v12.06,59.69 12.06,58.82
  Bottom 0.406: v12.7,65.41 arc90 12.06,64.77 v12.06,59.69
LRCK  (via drill 0.5)
  Top 0.406: U2.5 arc-90 8.49,58.1 v9.84,58.1 | v31.11,53.98 31.82,53.98 arc90 IC2.1
  Bottom 0.406: v9.84,58.1 arc90 13.97,53.98 v31.11,53.98
N$1
  Top 0.406: U2.15 14.7,53.88 arc90 15.88,52.7 18.73,52.7 arc90 21.27,55.24 21.27,55.78 arc90 R2.2
N$2
  Top 0.406: C5.1 arc90 8.41,62.71 U2.32
N$3
  Top 0.406: U2.30 11.5,64.28 arc90 C9.2
N$4
  Top 0.406: U2.27 13.9,64.28 arc-90 C10.2
N$5
  Top 0.406: IC2.14 42.91,54.76 arc90 C36.1
  Top 0.813: C36.1 46.57,55.03 arc-90 C39.1
N$7
  Top 0.61: C46.2 C45.2 arc90 32.7,16.19 R25.P$1 | IC4.2 R24.P$2
  Bottom 0.61: R24.P$2 R25.P$1
N$8
  Top 0.813: R7.1 41.91,43.18 arc-90 C24.+
N$9
  Top 0.813: L1.1 14.62,23.95 arc-90 C18.2 arc90 12.33,26.25 C14.2 5.82,26.25 arc-90 4.45,27.62 IC1.5
N$10
  Top 0.813: R6.2 41.91,30.48 arc-90 C23.-
N$11
  Top 0.813: IC1.2 6.99,36.62 arc-90 C4.1 12.36,37.25 arc90 12.7,37.59 C6.1
N$12
  Top 0.61: IC4.3 35.24,10.79 arc90 R23.P$2 arc-90 31.11,6.67 27.62,6.67 arc90 C43.2
N$13
  Top 0.813: IC1.4 4.45,35.77 arc-90 C4.2 10.53,38.95 arc90 C6.2
N$14
  Top 0.61: C51.1 55.24,5.08 arc90 59.69,9.53 arc-90 62.23,12.06 63.5,12.06 arc-90 66.04,9.53 R22.R2.2
N$15
  Top 0.61: IC4.5 arc90 42.3,9.21 R26.P$2 arc-90 47.62,6.67 C51.2
N$16
  Top 0.61: C30.1 C29.2
N$17
  Top 0.61: R13.P$2 R19.P$1 R11.P$1
  Bottom 0.61: C30.2 R13.P$2
N$18
  Top 0.61: R10.P$1 R18.P$1 R17.P$1
  Bottom 0.61: C29.1 R17.P$1
N$19
  Top 0.61: C54.2 C53.2 arc-90 45.72,16.19 R28.P$1 | IC4.6 43.81,10.79 arc90 R27.P$2
  Bottom 0.61: R27.P$2 R28.P$1
N$20
  Top 0.61: R12.P$2 R16.P$1 R9.P$1
  Bottom 0.61: C28.2 R12.P$2
N$21
  Top 0.61: R8.P$1 R15.P$1 R14.P$1
  Bottom 0.61: C27.1 R14.P$1
N$22
  Top 0.61: C28.1 C27.2
N$23
  Bottom 0.61: C43.1 arc-90 31.43,5.4 44.77,5.4 arc-90 45.72,4.45 arc90 46.67,3.49 63.18,3.49 arc90 R22.R1.2
N$24
  Top 0.61: R27.P$1 56.52,12.06 arc90 C52.2
N$25
  Bottom 0.61: C44.2 arc90 22.23,12.06 R24.P$1
OPL+
  Top 0.61: IC3.3 R19.P$2 arc90 62.23,53.34 C32.2
OPL-
  Top 0.61: IC3.2 R18.P$2 67.31,54.61 arc-90 C34.1
OPR+
  Top 0.61: C31.2 62.23,35.56 arc90 R16.P$2 arc90 63.5,39.37 arc-90 IC3.5
OPR-
  Top 0.61: C33.1 arc-90 67.31,34.29 R15.P$2 arc90 66.04,39.37 arc-90 IC3.6
OUT_L
  Top 0.61: R20.P$2 45.72,78.23 arc90 J2.4
OUT_L*  (via drill 0.5)
  Top 0.61: IC3.1 69.85,50.8 | 69.85,50.8 69.85,52.07 arc-90 C34.2 | R17.P$2 69.85,50.8 | R20.P$1 arc90 47.62,66.67 v67.31,66.67
  Bottom 0.61: IC3.1 69.85,43.81 arc90 71.12,42.55 arc-90 73.03,40.64 73.03,10.84 arc-90 R22.R1.3 | v67.31,66.67 arc-90 73.03,60.96 73.03,55.24 arc-90 C34.2
OUT_R
  Top 0.61: R21.P$2 arc90 50.16,70.48 62.99,70.48 arc90 J2.2
OUT_R*  (via drill 0.5)
  Top 0.61: 71.12,38.1 arc90 69.85,39.37 68.58,39.37 arc-90 IC3.7 67.31,43.18 arc90 v64.77,45.72 | 71.12,38.1 C33.2 | R14.P$2 71.12,38.1
  Bottom 0.61: C33.2 arc90 69.22,33.66 69.22,24.13 arc-90 68.58,23.5 arc90 67.31,22.23 67.31,10.08 arc90 R22.R2.3 | v64.77,45.72 arc-90 59.05,51.44 59.05,55.24 arc90 54.61,59.69 arc-90 49.53,64.77 49.53,67.31 arc90 45.72,71.12 44.45,71.12 arc90 R21.P$1
SYSCK  (via drill 0.5)
  Top 0.406: U2.18 15.78,56.42 arc90 v15.24,55.88 | v34.61,56.52 arc-90 35.2,55.92 IC2.5
  Bottom 0.406: v15.24,55.88 arc-90 15.88,56.52 v34.61,56.52
VCC
  Top 0.406: 21.27,74.93 arc90 21.23,74.97 J1.VBUS
  Top 0.61: U2.24 19.21,61.22 arc-90 C12.1
  Top 0.813: IC1.1 8.26,30.48 | 8.26,30.48 IC1.8 | 8.26,30.48 arc-90 8.68,30.9 C15.1 arc90 11.85,30.48 C16.1 arc90 18.1,33.34 18.1,37.88 arc-90 L2.1 19.41,43.55 arc-90 21.59,45.72 arc90 23.5,47.62 23.5,67.31 | 23.5,67.31 23.5,71.12 arc90 22.23,72.39 arc-90 21.27,73.34 21.27,74.93 | 23.5,67.31 21.59,67.31 arc90 C13.1 19.05,61.38 arc90 C12.1
VOUTL+
  Top 0.406: IC2.17 39.76,60.58 arc90 40.64,59.69 53.34,59.69 arc90 54.61,60.96 R11.P$2
VOUTL-
  Top 0.406: IC2.18 39.1,60.59 arc90 40.64,59.05 53.34,59.05 arc90 55.24,60.96 arc-90 57.15,62.87 61.59,62.87 arc90 62.87,64.14 arc-90 64.14,65.41 75.56,65.41 arc-90 R10.P$2
VOUTR+
  Top 0.406: IC2.13 40.41,54.21 arc90 41.27,53.34 arc-90 53.34,41.27 53.34,26.67 arc90 R9.P$2
VOUTR-
  Top 0.406: IC2.12 39.76,54.23 arc90 41.27,52.7 arc-90 52.7,41.27 52.7,25.08 arc90 54.29,23.5 75.56,23.5 arc90 R8.P$2
XTI
  Top 0.406: R1.1 arc90 12.3,52.52 U2.12
  Top 0.61: C7.1 Y1.1 arc90 11.85,49.95 R1.1
XTO
  Top 0.406: R1.2 arc-90 13.1,52.52 U2.13
  Top 0.61: R1.2 13.55,49.95 arc90 Y1.2 C11.1

### Text on the board
tPlace: Mantis Audio | DAC1